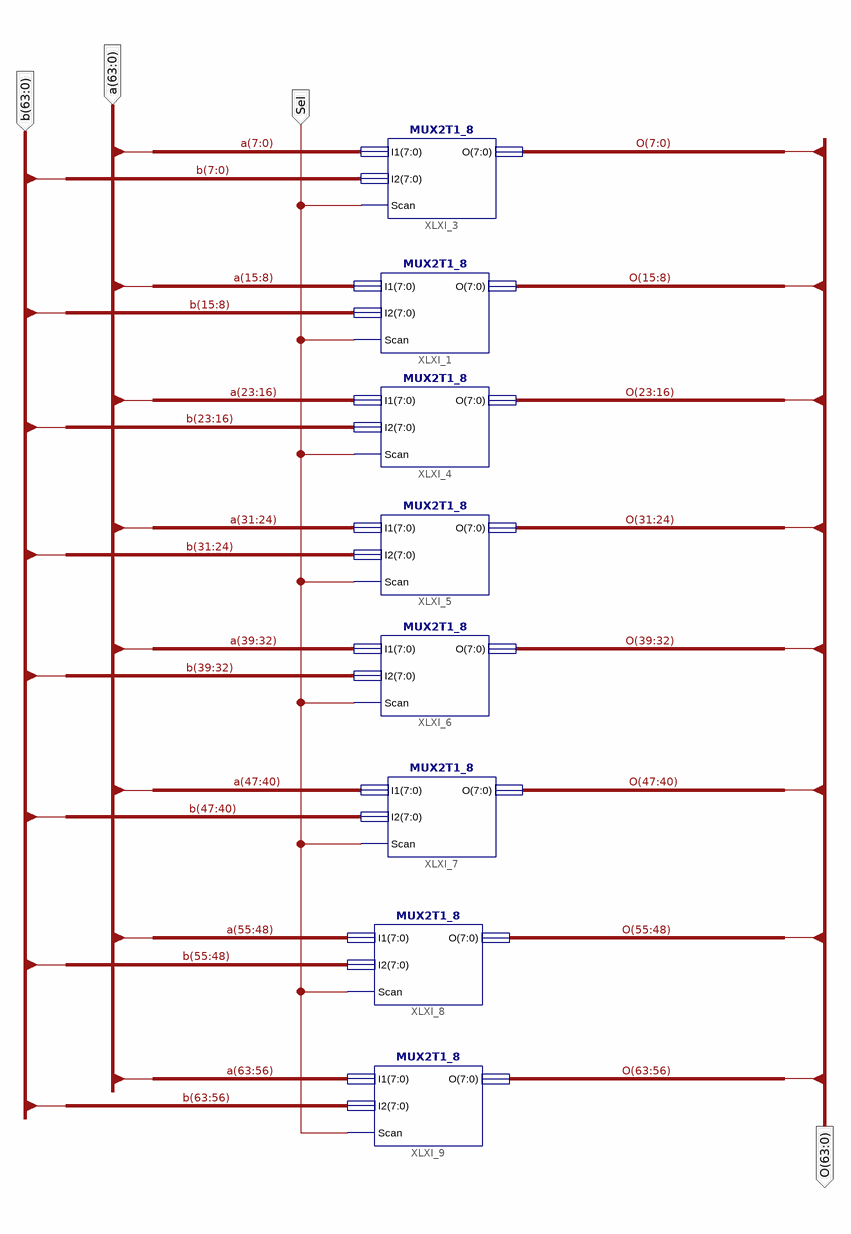
[diagram p0: schematic sheet 1]
// Xilinx ISE schematic MUX2T1_64.sch (kintex7) as structural Verilog: 8 symbols, 4 ports
module MUX2T1_64 (
  input  Sel,
  input  [63:0] a,
  input  [63:0] b,
  output [63:0] O
);

  MUX2T1_8 XLXI_1 (.I1(a[15:8]), .I2(b[15:8]), .Scan(Sel), .O(O[15:8]));
  MUX2T1_8 XLXI_3 (.I1(a[7:0]), .I2(b[7:0]), .Scan(Sel), .O(O[7:0]));
  MUX2T1_8 XLXI_4 (.I1(a[23:16]), .I2(b[23:16]), .Scan(Sel), .O(O[23:16]));
  MUX2T1_8 XLXI_5 (.I1(a[31:24]), .I2(b[31:24]), .Scan(Sel), .O(O[31:24]));
  MUX2T1_8 XLXI_6 (.I1(a[39:32]), .I2(b[39:32]), .Scan(Sel), .O(O[39:32]));
  MUX2T1_8 XLXI_7 (.I1(a[47:40]), .I2(b[47:40]), .Scan(Sel), .O(O[47:40]));
  MUX2T1_8 XLXI_8 (.I1(a[55:48]), .I2(b[55:48]), .Scan(Sel), .O(O[55:48]));
  MUX2T1_8 XLXI_9 (.I1(a[63:56]), .I2(b[63:56]), .Scan(Sel), .O(O[63:56]));
endmodule
